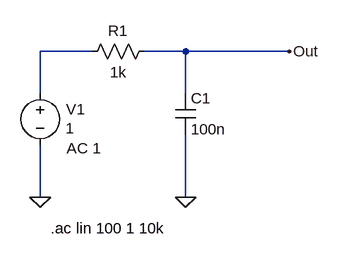
[diagram p0: schematic LowPassFilter_RC.asc]
LowPassFilter_RC.asc, the LTspice schematic file:
Version 4.1
SHEET 1 880 680
WIRE -16 144 -96 144
WIRE 128 144 64 144
WIRE 288 144 128 144
WIRE -96 208 -96 144
WIRE 128 208 128 144
WIRE -96 368 -96 288
WIRE 128 368 128 272
FLAG -96 368 0
FLAG 288 144 Out
FLAG 128 368 0
SYMBOL res 80 128 R90
WINDOW 0 0 56 VBottom 2
WINDOW 3 32 56 VTop 2
SYMATTR InstName R1
SYMATTR Value 1k
SYMBOL voltage -96 192 R0
WINDOW 123 41 101 Left 2
WINDOW 39 0 0 Left 0
WINDOW 0 40 41 Left 2
WINDOW 3 39 70 Left 2
SYMATTR Value2 AC 1
SYMATTR InstName V1
SYMATTR Value 1
SYMBOL cap 112 208 R0
SYMATTR InstName C1
SYMATTR Value 100n
TEXT -80 416 Left 2 !.ac lin 100 1 10k

The netlist it stands for:
* LowPassFilter_RC.asc
R1 Out N001 1k
V1 N001 0 1 AC 1
C1 Out 0 100n
.ac lin 100 1 10k
.backanno
.end

* Results of the author's LTspice run, read from the files saved beside the schematic
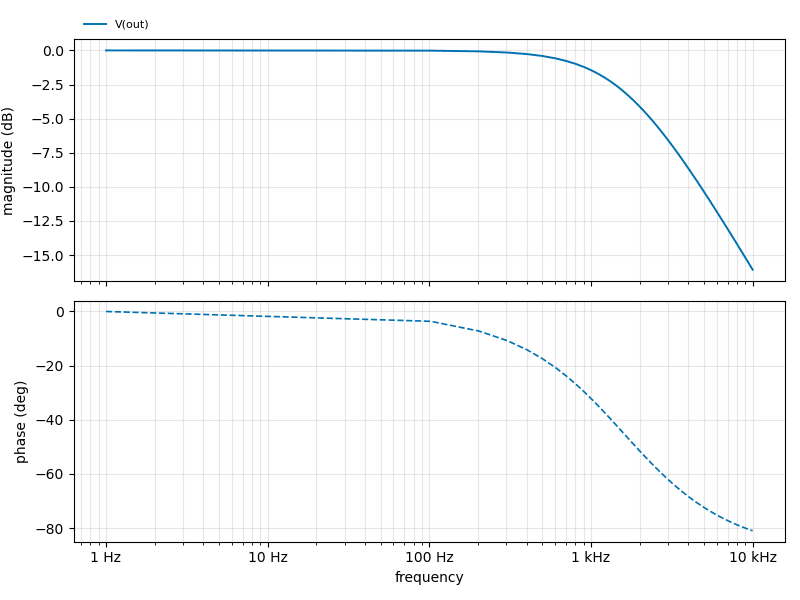
[diagram p1: AC Analysis of LowPassFilter_RC.asc, plotted from the saved traces]
* AC Analysis, 1 run:
*   V(out): -0.00 dB at 1 Hz, -16.07 dB at 10 kHz, peak -0.00 dB at 1 Hz, 3 dB below the peak at 1.591 kHz